# EAGLE design bierkasten (EAGLE 9.1.3)
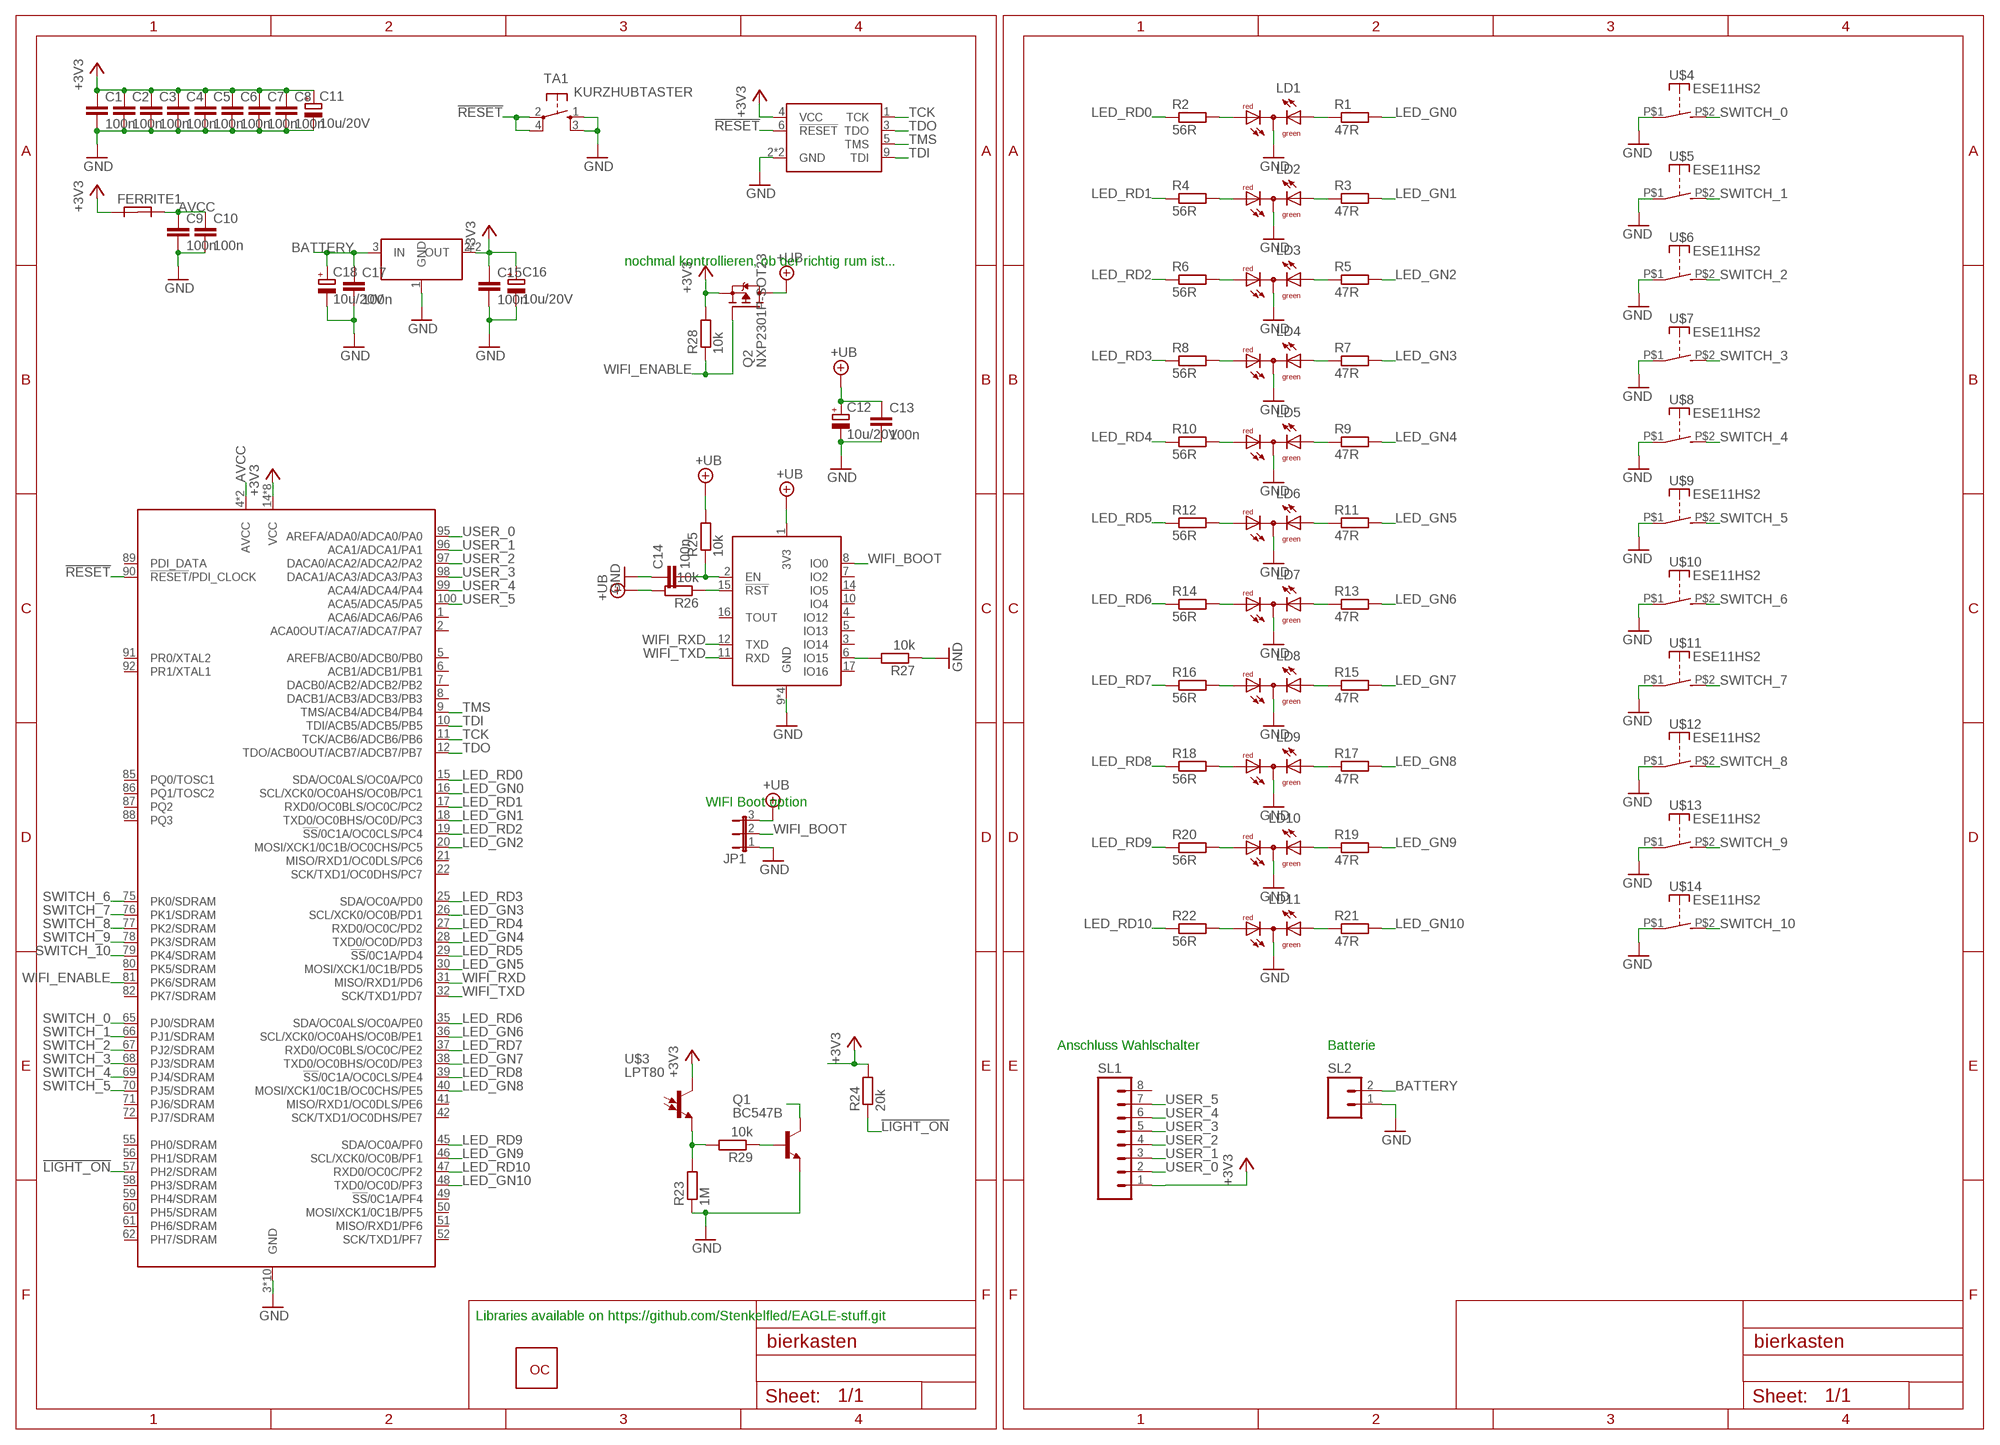
[diagram p0: schematic, sheet 1]

## Parts
C1  100n  C-EUC0603  [C0603]
C2  100n  C-EUC0603  [C0603]
C3  100n  C-EUC0603  [C0603]
C4  100n  C-EUC0603  [C0603]
C5  100n  C-EUC0603  [C0603]
C6  100n  C-EUC0603  [C0603]
C7  100n  C-EUC0603  [C0603]
C8  100n  C-EUC0603  [C0603]
C9  100n  C-EUC0603  [C0603]
C10  100n  C-EUC0603  [C0603]
C11  10u/20V  CPOL-EUB/3528-21W  [B/3528-21W]
C12  10u/20V  CPOL-EUB/3528-21W  [B/3528-21W]
C13  100n  C-EUC0603  [C0603]
C14  100n  C-EUC0603  [C0603]
C15  100n  C-EUC0603  [C0603]
C16  10u/20V  CPOL-EUB/3528-21W  [B/3528-21W]
C17  100n  C-EUC0603  [C0603]
C18  10u/20V  CPOL-EUB/3528-21W  [B/3528-21W]
FERRITE1  FERRITE-EU_0805  [L0805]
JP1  JP2E  [JP2]
LD1  DUOLED-RG-C-WIRE  [DUOLED-C-WIRE]
LD2  DUOLED-RG-C-WIRE  [DUOLED-C-WIRE]
LD3  DUOLED-RG-C-WIRE  [DUOLED-C-WIRE]
LD4  DUOLED-RG-C-WIRE  [DUOLED-C-WIRE]
LD5  DUOLED-RG-C-WIRE  [DUOLED-C-WIRE]
LD6  DUOLED-RG-C-WIRE  [DUOLED-C-WIRE]
LD7  DUOLED-RG-C-WIRE  [DUOLED-C-WIRE]
LD8  DUOLED-RG-C-WIRE  [DUOLED-C-WIRE]
LD9  DUOLED-RG-C-WIRE  [DUOLED-C-WIRE]
LD10  DUOLED-RG-C-WIRE  [DUOLED-C-WIRE]
LD11  DUOLED-RG-C-WIRE  [DUOLED-C-WIRE]
Q1  BC547B  [TO92]
Q2  NXP2301P-SOT23  [SOT23]
R1  47R  R-EU_R0603  [R0603]
R2  56R  R-EU_R0603  [R0603]
R3  47R  R-EU_R0603  [R0603]
R4  56R  R-EU_R0603  [R0603]
R5  47R  R-EU_R0603  [R0603]
R6  56R  R-EU_R0603  [R0603]
R7  47R  R-EU_R0603  [R0603]
R8  56R  R-EU_R0603  [R0603]
R9  47R  R-EU_R0603  [R0603]
R10  56R  R-EU_R0603  [R0603]
R11  47R  R-EU_R0603  [R0603]
R12  56R  R-EU_R0603  [R0603]
R13  47R  R-EU_R0603  [R0603]
R14  56R  R-EU_R0603  [R0603]
R15  47R  R-EU_R0603  [R0603]
R16  56R  R-EU_R0603  [R0603]
R17  47R  R-EU_R0603  [R0603]
R18  56R  R-EU_R0603  [R0603]
R19  47R  R-EU_R0603  [R0603]
R20  56R  R-EU_R0603  [R0603]
R21  47R  R-EU_R0603  [R0603]
R22  56R  R-EU_R0603  [R0603]
R23  1M  R-EU_R0603  [R0603]
R24  20k  R-EU_R0603  [R0603]
R25  10k  R-EU_R0603  [R0603]
R26  10k  R-EU_R0603  [R0603]
R27  10k  R-EU_R0603  [R0603]
R28  10k  R-EU_R0603  [R0603]
R29  10k  R-EU_R0603  [R0603]
SL1  M08  [08P]
SL2  M02  [02P]
TA1  KURZHUBTASTER  [TA93XX]
U$1  ATXMEGA_A1  [TQFP100]
U$2  AVR-JTAG-10  [WANNE10G]
U$3  LPT80  [LPT80]
U$4  ESE11HS2  SWITCH_SINGLE-WIRED  [2X2,54]
U$5  ESE11HS2  SWITCH_SINGLE-WIRED  [2X2,54]
U$6  ESE11HS2  SWITCH_SINGLE-WIRED  [2X2,54]
U$7  ESE11HS2  SWITCH_SINGLE-WIRED  [2X2,54]
U$8  ESE11HS2  SWITCH_SINGLE-WIRED  [2X2,54]
U$9  ESE11HS2  SWITCH_SINGLE-WIRED  [2X2,54]
U$10  ESE11HS2  SWITCH_SINGLE-WIRED  [2X2,54]
U$11  ESE11HS2  SWITCH_SINGLE-WIRED  [2X2,54]
U$12  ESE11HS2  SWITCH_SINGLE-WIRED  [2X2,54]
U$13  ESE11HS2  SWITCH_SINGLE-WIRED  [2X2,54]
U$14  ESE11HS2  SWITCH_SINGLE-WIRED  [2X2,54]
U$15  ESP8266-POLLIN  [ESP8266-POLLIN]
U$16  NCP1117ST33T3G  NCP1117ST33  [SOT223]
U$17  BESTELLTEILE  [BESTELLTEILE]

## Nets
!LIGHT_ON: R24.1 U$1.57(PH2/SDRAM)
!RESET: TA1.2(P) TA1.4(P1) U$1.90(!RESET!/PDI_CLOCK) U$2.6(!RESET)
+3V3: C1.1 C2.1 C3.1 C4.1 C5.1 C6.1 C7.1 C8.1 C11.+ C15.1 C16.+ FERRITE1.1 Q2.2(S) R24.2 R28.2 SL1.1 U$1.14(VCC) U$1.24(VCC) U$1.34(VCC) U$1.44(VCC) U$1.54(VCC) U$1.64(VCC) U$1.74(VCC) U$1.83(VCC) U$2.4(VCC) U$3.C U$16.2(OUT) U$16.4(OUT)
+UB: C12.+ C13.1 JP1.3 Q2.3(D) R25.2 R26.2 U$15.1(3V3)
AVCC: C9.1 C10.1 FERRITE1.2 U$1.4(AVCC) U$1.94(AVCC)
BATTERY: C17.1 C18.+ SL2.2 U$16.3(IN)
GND: C1.2 C2.2 C3.2 C4.2 C5.2 C6.2 C7.2 C8.2 C9.2 C10.2 C11.- C12.- C13.2 C14.1 C15.2 C16.- C17.2 C18.- JP1.1 LD1.C LD2.C LD3.C LD4.C LD5.C LD6.C LD7.C LD8.C LD9.C LD10.C LD11.C Q1.1(E) R23.1 R27.1 SL2.1 TA1.1(S) TA1.3(S1) U$1.3(GND) U$1.13(GND) U$1.23(GND) U$1.33(GND) U$1.43(GND) U$1.53(GND) U$1.63(GND) U$1.73(GND) U$1.84(GND) U$1.93(GND) U$2.2(GND) U$2.10(GND) U$4.P$1(P) U$5.P$1(P) U$6.P$1(P) U$7.P$1(P) U$8.P$1(P) U$9.P$1(P) U$10.P$1(P) U$11.P$1(P) U$12.P$1(P) U$13.P$1(P) U$14.P$1(P) U$15.9(GND) U$15.13(GND) U$15.18(GND) U$15.19(GND) U$16.1(GND)
LED_GN0: R1.2 U$1.16(SCL/XCK0/OC0AHS/OC0B/PC1)
LED_GN1: R3.2 U$1.18(TXD0/OC0BHS/OC0D/PC3)
LED_GN2: R5.2 U$1.20(MOSI/XCK1/0C1B/OC0CHS/PC5)
LED_GN3: R7.2 U$1.26(SCL/XCK0/OC0B/PD1)
LED_GN4: R9.2 U$1.28(TXD0/OC0D/PD3)
LED_GN5: R11.2 U$1.30(MOSI/XCK1/0C1B/PD5)
LED_GN6: R13.2 U$1.36(SCL/XCK0/OC0AHS/OC0B/PE1)
LED_GN7: R15.2 U$1.38(TXD0/OC0BHS/OC0D/PE3)
LED_GN8: R17.2 U$1.40(MOSI/XCK1/0C1B/OC0CHS/PE5)
LED_GN9: R19.2 U$1.46(SCL/XCK0/OC0B/PF1)
LED_GN10: R21.2 U$1.48(TXD0/OC0D/PF3)
LED_RD0: R2.1 U$1.15(SDA/OC0ALS/OC0A/PC0)
LED_RD1: R4.1 U$1.17(RXD0/OC0BLS/OC0C/PC2)
LED_RD2: R6.1 U$1.19(!SS!/0C1A/OC0CLS/PC4)
LED_RD3: R8.1 U$1.25(SDA/OC0A/PD0)
LED_RD4: R10.1 U$1.27(RXD0/OC0C/PD2)
LED_RD5: R12.1 U$1.29(!SS!/0C1A/PD4)
LED_RD6: R14.1 U$1.35(SDA/OC0ALS/OC0A/PE0)
LED_RD7: R16.1 U$1.37(RXD0/OC0BLS/OC0C/PE2)
LED_RD8: R18.1 U$1.39(!SS!/0C1A/OC0CLS/PE4)
LED_RD9: R20.1 U$1.45(SDA/OC0A/PF0)
LED_RD10: R22.1 U$1.47(RXD0/OC0C/PF2)
N$1: LD1.AR R2.2
N$2: LD1.AX(AG) R1.1
N$3: LD2.AR R4.2
N$4: LD2.AX(AG) R3.1
N$5: LD3.AR R6.2
N$6: LD3.AX(AG) R5.1
N$7: LD4.AR R8.2
N$8: LD4.AX(AG) R7.1
N$9: LD5.AR R10.2
N$10: LD5.AX(AG) R9.1
N$11: LD6.AR R12.2
N$12: LD6.AX(AG) R11.1
N$13: LD7.AR R14.2
N$14: LD7.AX(AG) R13.1
N$15: LD8.AR R16.2
N$16: LD8.AX(AG) R15.1
N$17: LD9.AR R18.2
N$18: LD9.AX(AG) R17.1
N$19: LD10.AR R20.2
N$20: LD10.AX(AG) R19.1
N$21: LD11.AR R22.2
N$22: LD11.AX(AG) R21.1
N$23: R23.2 R29.2 U$3.E
N$24: C14.2 R25.1 U$15.2(EN)
N$25: R27.2 U$15.6(IO15)
N$26: R26.1 U$15.15(!RST)
N$27: Q1.3(C)
N$28: Q1.2(B) R29.1
SWITCH_0: U$1.65(PJ0/SDRAM) U$4.P$2(S)
SWITCH_1: U$1.66(PJ1/SDRAM) U$5.P$2(S)
SWITCH_2: U$1.67(PJ2/SDRAM) U$6.P$2(S)
SWITCH_3: U$1.68(PJ3/SDRAM) U$7.P$2(S)
SWITCH_4: U$1.69(PJ4/SDRAM) U$8.P$2(S)
SWITCH_5: U$1.70(PJ5/SDRAM) U$9.P$2(S)
SWITCH_6: U$1.75(PK0/SDRAM) U$10.P$2(S)
SWITCH_7: U$1.76(PK1/SDRAM) U$11.P$2(S)
SWITCH_8: U$1.77(PK2/SDRAM) U$12.P$2(S)
SWITCH_9: U$1.78(PK3/SDRAM) U$13.P$2(S)
SWITCH_10: U$1.79(PK4/SDRAM) U$14.P$2(S)
TCK: U$1.11(TCK/ACB6/ADCB6/PB6) U$2.1(TCK)
TDI: U$1.10(TDI/ACB5/ADCB5/PB5) U$2.9(TDI)
TDO: U$1.12(TDO/ACB0OUT/ACB7/ADCB7/PB7) U$2.3(TDO)
TMS: U$1.9(TMS/ACB4/ADCB4/PB4) U$2.5(TMS)
USER_0: SL1.2 U$1.95(AREFA/ADA0/ADCA0/PA0)
USER_1: SL1.3 U$1.96(ACA1/ADCA1/PA1)
USER_2: SL1.4 U$1.97(DACA0/ACA2/ADCA2/PA2)
USER_3: SL1.5 U$1.98(DACA1/ACA3/ADCA3/PA3)
USER_4: SL1.6 U$1.99(ACA4/ADCA4/PA4)
USER_5: SL1.7 U$1.100(ACA5/ADCA5/PA5)
WIFI_BOOT: JP1.2 U$15.8(IO0)
WIFI_ENABLE: Q2.1(G) R28.1 U$1.81(PK6/SDRAM)
WIFI_RXD: U$1.31(MISO/RXD1/PD6) U$15.12(TXD)
WIFI_TXD: U$1.32(SCK/TXD1/PD7) U$15.11(RXD)
Unconnected: SL1.8 U$1.1(ACA6/ADCA6/PA6) U$1.2(ACA0OUT/ACA7/ADCA7/PA7) U$1.5(AREFB/ACB0/ADCB0/PB0) U$1.6(ACB1/ADCB1/PB1) U$1.7(DACB0/ACB2/ADCB2/PB2) U$1.8(DACB1/ACB3/ADCB3/PB3) U$1.21(MISO/RXD1/OC0DLS/PC6) U$1.22(SCK/TXD1/OC0DHS/PC7) U$1.41(MISO/RXD1/OC0DLS/PE6) U$1.42(SCK/TXD1/OC0DHS/PE7) U$1.49(!SS!/0C1A/PF4) U$1.50(MOSI/XCK1/0C1B/PF5) U$1.51(MISO/RXD1/PF6) U$1.52(SCK/TXD1/PF7) U$1.55(PH0/SDRAM) U$1.56(PH1/SDRAM) U$1.58(PH3/SDRAM) U$1.59(PH4/SDRAM) U$1.60(PH5/SDRAM) U$1.61(PH6/SDRAM) U$1.62(PH7/SDRAM) U$1.71(PJ6/SDRAM) U$1.72(PJ7/SDRAM) U$1.80(PK5/SDRAM) U$1.82(PK7/SDRAM) U$1.85(PQ0/TOSC1) U$1.86(PQ1/TOSC2) U$1.87(PQ2) U$1.88(PQ3) U$1.89(PDI_DATA) U$1.91(PR0/XTAL2) U$1.92(PR1/XTAL1) U$15.3(IO14) U$15.4(IO12) U$15.5(IO13) U$15.7(IO2) U$15.10(IO4) U$15.14(IO5) U$15.16(TOUT) U$15.17(IO16)

## Notes on the sheet
- nochmal kontrollieren, ob der richtig rum ist...
- WIFI Boot option
- Anschluss Wahlschalter | Batterie
- Libraries available on https://github.com/Stenkelfled/EAGLE-stuff.git

## Library data of the parts
C1-C10 C13-C15 C17 = rcl_STE:C-EU: CAPACITOR, European symbol; FARNELL: 432210; REICHELT: X7R-G0603 100N; SPICEPREFIX: C
C11 C12 C16 C18 = rcl:CPOL-EU: POLARIZED CAPACITOR, European symbol; REICHELT: TAJ 3528 10/20; SPICEPREFIX: C
FERRITE1 = ferrite_STE:FERRITE-EU_0805: Ferritperle; REICHELT: BLM21PG 331
JP1 = jumper:JP2E: JUMPER
LD1-LD11 = opto_STE:DUOLED-RG-C: DUO LED 2 colors (red/green), 5 mm, round, common Cathode www.ligitek.com or other producers.; REICHELT: LED 5 RG-3
Q1 = transistor-npn:BC547*: NPN Transistor; REICHELT: BC 547B
Q2 = mosfet_STE:NXP2301P: P-MOSFET; REICHELT: NX2301P NXP
R1 R3 R5 R7 R9 R11 R13 R17 R19 R21 = rcl_STE:R-EU_: RESISTOR, European symbol; FARNELL: 2502461; REICHELT: RND 0603 1 47; SPICEPREFIX: R
R2 R4 R6 R8 R10 R12 R14 R16 R18 R20 R22 = rcl_STE:R-EU_: RESISTOR, European symbol; REICHELT: RND 0603 1 56; SPICEPREFIX: R
R15 = rcl:R-EU_: RESISTOR, European symbol; FARNELL: 2502461; REICHELT: RND 0603 1 47; SPICEPREFIX: R
R23 R29 = rcl_STE:R-EU_: RESISTOR, European symbol; REICHELT: RND 0603 1 1,0M; SPICEPREFIX: R
R24 = rcl_STE:R-EU_: RESISTOR, European symbol; REICHELT: RND 0603 1 20K; SPICEPREFIX: R
R25-R28 = rcl:R-EU_: RESISTOR, European symbol; FARNELL: 2502397; REICHELT: RND 0603 1 10K; SPICEPREFIX: R
SL1 = con-amp-quick:M08: AMP QUICK CONNECTOR; OC_FARNELL: unknown; OC_NEWARK: unknown; REICHELT: PSS 254/8G:PSK 254/8W
SL2 = con-amp-quick:M02: AMP QUICK CONNECTOR; OC_FARNELL: unknown; OC_NEWARK: unknown; REICHELT: PSS 254/2G:PSK 254/2W
TA1 = switch_STE:KURZHUBTASTER; FARNELL: 2292960; REICHELT: Taster 9314; WUERTH: 430 182 043 816
U$1 = uC_STE:ATXMEGA_A1; REICHELT: ATXMEGA 128A1-AU
U$2 = con_STE:AVR-JTAG; REICHELT: WSL 10G
U$3 = misc_STE:LPT80: Fototransistor; REICHELT: LPT 80
U$4-U$14 = switch_STE:SWITCH_SINGLE; REICHELT: ESE 11HS2
U$15 = misc_STE:ESP8266: https://www.pollin.de/p/espressif-esp-wroom-02-esp8266-wi-fi-modul-810696 Doku: https://www.pollin.de/productdownloads/D810696B.PDF
U$16 = power_STE:NCP1117ST33: 3,3V LDO-Linearregler; REICHELT: NCP 1117 ST33T3G
U$17 = misc_STE:BESTELLTEILE; REICHELT: SL 1X36G 2,54:JUMPER 2,54 GN*10:HALTER 4XUM3-1DK:CLIP 9V

## Net classes
0 default: width 0.2 mm
1 power: width 0.3 mm

## Board
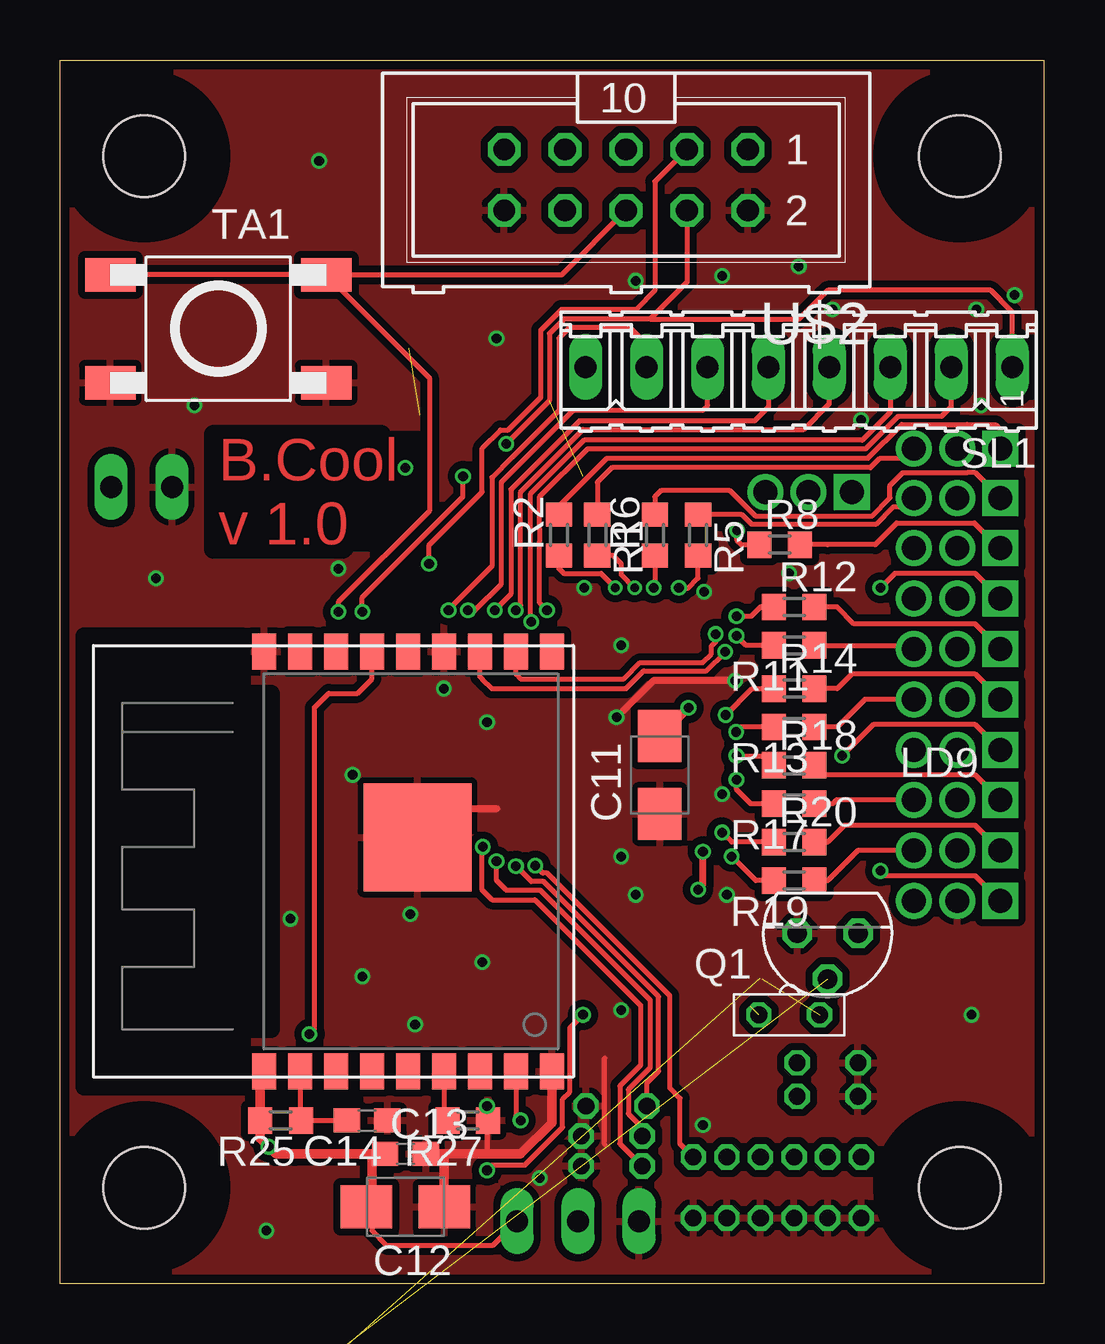
[diagram p1: board, top side]
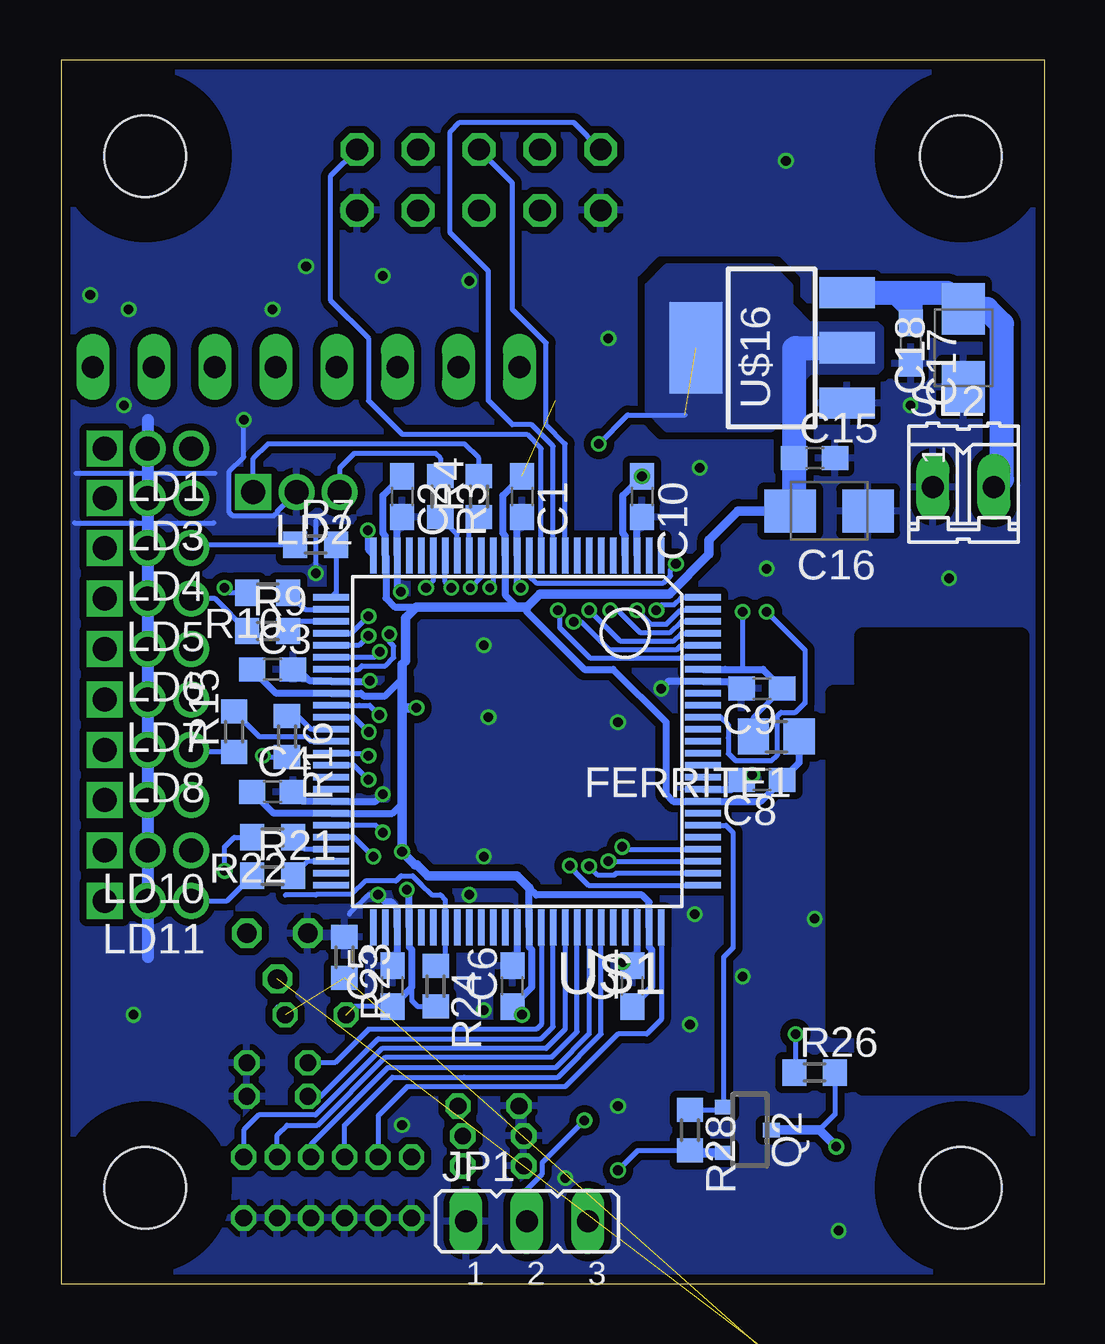
[diagram p2: board, bottom side, seen from below]

Size 41 x 51 mm. Coordinates in mm from the lower left corner, seen from the top.
Outline: 41,0 0,0 0,51 41,51 41,0
Copper layers (1*16): Top 0.035559375mm / dielectric 1.6mm / Bottom 0.035559375mm
Design rules "oshpark-2layer *": minimum track width 6mil, minimum drill 10mil, track to track 6mil, track to pad 6mil, pad to pad 6mil, via to via 6mil, smd to smd 0.1mm, copper to edge 15mil, drill to drill 6mil, minimum pad ring 5mil, minimum via ring 5mil, stop-mask expansion 2.5mil, vias tented up to drill 1mm, thermal gap 10mil
Holes 3.4 mm at 37.5,4 3.5,4 3.5,47 37.5,47
tRestrict: area 34.3,0.8 to 40.7,7.2; area 0.3,0.8 to 6.7,7.2; area 0.3,43.8 to 6.7,50.2; area 34.3,43.8 to 40.7,50.2; 8 lines
bRestrict: area 34.3,0.8 to 40.7,7.2; area 0.3,0.8 to 6.7,7.2; area 0.3,43.8 to 6.7,50.2; area 34.3,43.8 to 40.7,50.2

### Footprints (pad centres in the part's own frame; a part is rotated, then mirrored left to right if it is on the bottom)
C0603 = smd 1.1 x 1: 1 -0.85,0; 2 0.85,0
B/3528-21W = smd 2.15 x 1.8: + 1.625,0; - -1.625,0
L0805 = smd 1.3 x 1.5: 1 -0.95,0; 2 0.95,0
JP2 = drill 0.914 long: 1 -2.54,0; 2 0,0; 3 2.54,0
DUOLED-C-WIRE = drill 1 square: AR 1.8,0 | drill 1: AX -1.8,0; C 0,0
TO92 = drill 0.813 octagon: 1 1.27,0; 2 0,1.905; 3 -1.27,0
SOT23 = smd 0.6 x 0.7: 1 -0.95,-1; 2 0.95,-1; 3 0,1
R0603 = smd 1 x 1.1: 1 -0.85,0; 2 0.85,0
08P = drill 0.914 long: 1 -8.89,0; 2 -6.35,0; 3 -3.81,0; 4 -1.27,0; 5 1.27,0; 6 3.81,0; 7 6.35,0; 8 8.89,0
02P = drill 0.914 long: 1 -1.27,0; 2 1.27,0
TA93XX = smd 2.1 x 1.4: 1 4.5,2.25; 2 4.5,-2.25; 3 -4.5,2.25; 4 -4.5,-2.25
TQFP100 = smd 0.27 x 1.5: 1 -6,-7.75; 2 -5.5,-7.75; 3 -5,-7.75; 4 -4.5,-7.75; 5 -4,-7.75; 6 -3.5,-7.75; 7 -3,-7.75; 8 -2.5,-7.75; 9 -2,-7.75; 10 -1.5,-7.75; 11 -1,-7.75; 12 -0.5,-7.75; 13 0,-7.75; 14 0.5,-7.75; 15 1,-7.75; 16 1.5,-7.75; 17 2,-7.75; 18 2.5,-7.75; 19 3,-7.75; 20 3.5,-7.75; 21 4,-7.75; 22 4.5,-7.75; 23 5,-7.75; 24 5.5,-7.75; 25 6,-7.75; 51 6,7.75; 52 5.5,7.75; 53 5,7.75; 54 4.5,7.75; 55 4,7.75; 56 3.5,7.75; 57 3,7.75; 58 2.5,7.75; 59 2,7.75; 60 1.5,7.75; 61 1,7.75; 62 0.5,7.75; 63 0,7.75; 64 -0.5,7.75; 65 -1,7.75; 66 -1.5,7.75; 67 -2,7.75; 68 -2.5,7.75; 69 -3,7.75; 70 -3.5,7.75; 71 -4,7.75; 72 -4.5,7.75; 73 -5,7.75; 74 -5.5,7.75; 75 -6,7.75 | smd 1.5 x 0.27: 26 7.75,-6; 27 7.75,-5.5; 28 7.75,-5; 29 7.75,-4.5; 30 7.75,-4; 31 7.75,-3.5; 32 7.75,-3; 33 7.75,-2.5; 34 7.75,-2; 35 7.75,-1.5; 36 7.75,-1; 37 7.75,-0.5; 38 7.75,0; 39 7.75,0.5; 40 7.75,1; 41 7.75,1.5; 42 7.75,2; 43 7.75,2.5; 44 7.75,3; 45 7.75,3.5; 46 7.75,4; 47 7.75,4.5; 48 7.75,5; 49 7.75,5.5; 50 7.75,6; 76 -7.75,6; 77 -7.75,5.5; 78 -7.75,5; 79 -7.75,4.5; 80 -7.75,4; 81 -7.75,3.5; 82 -7.75,3; 83 -7.75,2.5; 84 -7.75,2; 85 -7.75,1.5; 86 -7.75,1; 87 -7.75,0.5; 88 -7.75,0; 89 -7.75,-0.5; 90 -7.75,-1; 91 -7.75,-1.5; 92 -7.75,-2; 93 -7.75,-2.5; 94 -7.75,-3; 95 -7.75,-3.5; 96 -7.75,-4; 97 -7.75,-4.5; 98 -7.75,-5; 99 -7.75,-5.5; 100 -7.75,-6
WANNE10G = drill 0.914 octagon: 1 -5.08,-1.27; 2 -5.08,1.27; 3 -2.54,-1.27; 4 -2.54,1.27; 5 0,-1.27; 6 0,1.27; 7 2.54,-1.27; 8 2.54,1.27; 9 5.08,-1.27; 10 5.08,1.27
LPT80 = drill 0.7 octagon: C 1.27,0; E -1.27,0
2X2,54 = drill 0.7 octagon: P$1 -1.27,0; P$2 1.27,0
ESP8266-POLLIN = smd 1.5 x 1: 1 -9.55,6.3; 2 -9.55,4.8; 3 -9.55,3.3; 4 -9.55,1.8; 5 -9.55,0.3; 6 -9.55,-1.2; 7 -9.55,-2.7; 8 -9.55,-4.2; 9 -9.55,-5.7; 10 7.95,-5.7; 11 7.95,-4.2; 12 7.95,-2.7; 13 7.95,-1.2; 14 7.95,0.3; 15 7.95,1.8; 16 7.95,3.3; 17 7.95,4.8; 18 7.95,6.3 | smd 4.5 x 4.5: 19 0.2,-0.1
SOT223 = smd 1.3 x 2.3: 1 -2.3,-3.15; 2 0,-3.15; 3 2.3,-3.15 | smd 3.8 x 2.2: 4 0,3.15

### Placement (x,y rotation side)
C1  21.8,32.8 270 bottom
C2  26.8,32.8 270 bottom
C3  32.2,25.6 0 bottom
C4  32.2,20.5 0 bottom
C5  27.2,12.4 90 bottom
C6  22.2,12.4 90 bottom
C7  17.2,12.4 90 bottom
C8  11.8,21 180 bottom
C9  11.8,24.8 180 bottom
C10  16.8,32.8 270 bottom
C11  25,21.2 90 top
C12  14.4,3.2 180 top
C13  14.4,5.4 0 top
C14  12.8,6.8 180 top
C15  9.6,34.4 0 bottom
C16  9,32.2 180 bottom
C17  5.6,39.2 270 bottom
C18  3.4,39 90 bottom
FERRITE1  11.2,22.8 180 bottom
JP1  21.6,2.6 0 bottom
LD1  37.4,34.8 180 bottom
LD2  31.2,33 180 bottom
LD3  37.4,32.75 180 bottom
LD4  37.4,30.65 180 bottom
LD5  37.4,28.55 180 bottom
LD6  37.4,26.45 180 bottom
LD7  37.4,24.35 180 bottom
LD8  37.4,22.25 180 bottom
LD9  37.4,20.15 0 top
LD10  37.4,18.05 180 bottom
LD11  37.4,15.95 180 bottom
Q1  32,14.6 180 top
Q2  12.4,6.4 270 bottom
R1  22.4,31.2 270 top
R2  20.8,31.2 90 top
R3  25.2,32.8 270 bottom
R4  23.6,32.8 90 bottom
R5  26.6,31.2 270 top
R6  24.8,31.2 90 top
R7  30.4,30.8 0 bottom
R8  30,30.8 0 top
R9  32.4,27.2 0 bottom
R10  32.4,28.8 180 bottom
R11  30.6,26.6 180 top
R12  30.6,28.2 0 top
R13  30.6,23.2 180 top
R14  30.6,24.8 0 top
R15  33.8,23 90 bottom
R16  31.6,22.8 270 bottom
R17  30.6,20 180 top
R18  30.6,21.6 0 top
R19  30.6,16.8 180 top
R20  30.6,18.4 0 top
R21  32.2,17 0 bottom
R22  32.2,18.6 180 bottom
R23  29.2,13.6 270 bottom
R24  25.4,12.4 270 bottom
R25  9.2,6.8 180 top
R26  9.6,8.8 0 bottom
R27  17,6.8 180 top
R28  14.8,6.4 270 bottom
R29  1.4,-11.2 0 top  (outside the outline)
SL1  30.8,38.2 180 top
SL2  3.4,33.2 0 bottom
TA1  6.6,39.8 180 top
U$1  22,22.6 180 bottom
U$2  23.6,46 180 top
U$3  30.4,11.2 180 top
U$4  32,9.2 0 bottom
U$5  32,7.8 0 bottom
U$6  33.4,4 90 bottom
U$7  32,4 90 bottom
U$8  30.6,4 90 bottom
U$9  29.2,4 90 bottom
U$10  27.8,4 90 bottom
U$11  26.4,4 90 bottom
U$12  23.2,7.4 180 bottom
U$13  23,6.15 180 bottom
U$14  23,4.9 180 bottom
U$15  14.8,18.4 90 top
U$16  11.4,39 90 bottom
U$17  160.2,0 0 bottom  (outside the outline)

### Tracks (layer width: path | path; a pad name or v marks a point on that pad's centre or on a via)
!LIGHT_ON
  Bottom 0.2: R24.1 25,13.65 U$1.57 25,16 25.2,16.2 25.56,16.2 26.02,16.66 26.36,17 26.84,17 27.06,16.78 28.33,16.78 28.89,16.21 30.39,16.21 30.4,16.2 31.67,16.2
!RESET  (via drill 0.4)
  Top 0.2: TA1.4 20.92,42.05 U$2.6 | TA1.4 TA1.2 | TA1.4 15.4,37.75 15.4,32.2 11.6,28.4 v11.6,28
  Bottom 0.2: U$1.90 13.51,23.6 13.2,23.29 13.2,22.75 13.2,22.09 12.9,21.8 11.39,21.8 11.15,22.04 11.15,23.66 11.01,23.8 10.39,23.8 10,24.2 10,26.4 v11.6,28
+3V3  (via drill 0.4)  (3 unrouted)
  Top 0.2: 24.6,40.2 21,40.2 20.4,39.6 20.4,36.8 v18.6,35 | SL1.1 39.69,40.49 39.22,40.96 39.22,40.98 38.8,41.4 32,41.4 31.8,41.2 30.8,40.2 24.6,40.2 | v17.8,4.72 18.03,4.95 19.39,4.95 20.95,6.51 20.95,7.7 21.25,8 21.25,10.65 v21.8,11.2 | 24.6,40.2 26.14,41.74 26.14,42.04 U$2.4
  Top 0.3: v26.6,16.42 26.8,16.62 v26.8,18
  Top 0.4: C11.+ 26.18,24 v26.2,24
  Bottom 0.2: 26.4,12.35 26.4,11.8 26.15,11.55 R24.2 | C5.1 28.78,11.55 | C6.1 21.85,11.2 v21.8,11.2 | v17.8,4.72 16.97,5.55 R28.2 | 21.6,28.2 22,28.2 | v18.6,35 17.4,36.2 15,36.2
  Bottom 0.3: C3.1 32.05,24.6 U$1.34 28.51,24.6 28.41,24.5 27.5,24.5 26.8,25.2 | C4.1 32.15,19.6 U$1.44 27.2,19.6 26.8,20 | C2.1 27.6,32.85 27.6,31.27 27.5,31.17 U$1.24 27.48,30.33 27.48,28.57 27.11,28.2 26,28.2 | C5.1 26.4,12.35 26.4,13.93 26.5,14.03 U$1.54 26.5,16.32 v26.6,16.42 | C6.1 21.4,12.35 21.4,13.93 21.5,14.03 U$1.64 21.5,16.5 21.2,16.2 16.8,16.2 16.5,15.9 U$1.74 16.5,14.03 16.4,13.93 16.4,12.35 C7.1 | C1.1 22.6,32.85 22.6,31.27 22.5,31.17 U$1.14 22.5,28.7 22,28.2 | FERRITE1.1 10.25,21.7 C8.1 11.85,20.1 U$1.83 15.5,20.1 15.8,20.4 15.8,23.4 18,25.6 19.2,25.6 21.6,28 21.6,28.2
  Bottom 0.4: Q2.2 14.7,5.45 R28.2 | 26.8,24 26.8,25.2 26.8,25.8 26.65,25.95 26.65,27.75 26.2,28.2 26,28.2 22,28.2 21.6,28.2 21.05,28.75 19.6,28.75 18.4,28.75 15.65,28.75 14,30.4 14,31 12.8,32.2 C16.+ | 26.8,24 26.8,20 v26.8,18 26.25,17.45 26.17,17.45 25.72,17 22,17 21.5,16.5 | v26.2,24 26.8,24
  Bottom 1: U$16.2 10.4,39 10.45,38.95 C15.1 10.45,32.38 C16.+
  pour Bottom (isolate 0.3, no thermals): 7.4,40 9.8,40 10.6,40.8 10.6,41.6 11.4,42.4 15.8,42.4 16.6,41.6 16.6,36.4 15.8,35.6 11.4,35.6 10.6,36.4 10.6,37.2 9.8,38 7,38 6.8,38.2 6.8,39.8 7,40
+UB  (via drill 0.4)
  Top 0.2: 13,3.42 13,2.2 13.6,1.6 18.06,1.6 JP1.3
  Top 0.4: 13,5.4 C13.1 | C12.+ 13,3.42 13,5.4 | 13,5.4 9.8,5.4 9,5.4 v8.7,5.7 8.35,6.05 R25.2 8.35,8.7 U$15.1
  Bottom 0.2: R26.2 8.75,7.05 9.4,6.4
  Bottom 0.4: Q2.3 9.4,6.4 v8.7,5.7
AVCC  (via drill 0.4)
  Top 0.2: v12.6,28 12.6,28.6 16.8,32.8 C10.1
  Bottom 0.2: 12.6,25.6 v12.6,28 | FERRITE1.2 12.15,23.6 C9.1
  Bottom 0.3: U$1.4 17.5,31.17 17.6,31.27 17.6,32.85 C10.1 | U$1.94 13.33,25.6 13.32,25.6 12.6,25.6 11.75,25.6 C9.1
  other vias: 16.8,33.65
BATTERY
  Bottom 1: U$16.3 6.2,41.3 | 6.2,41.3 4.08,41.3 C18.+ 2.42,40.62 1.8,40 1.8,33.53 SL2.2 | C17.1 5.6,40.7 6.2,41.3
GND  (via drill 0.4)
  Top 0.2: R27.1 17.8,6.75 17.8,5.4 | 22.7,5.8 22.7,9.4
  Top 0.3: 16.6,19.8 18.2,19.8 | v28.15,25.13 24.73,25.13 v23.2,23.6
  Top 0.4: C13.2 16,5.4 | 16,5.4 17.8,5.4 19.2,5.4 20.5,6.7 U$15.9 | C12.- 16,3.23 16,5.4
  Bottom 0.2: C8.2 12.4,21 v12.2,21.2 | v26.85,28.83 27,28.98 27,29.6 | LD2.C 32,32.2 32,32.15 32.15,32 33.85,32 34,32.15 34,33.85 33.4,34.46 v33.4,36 | 30.4,31.8 30.4,29.4 | 28.2,16.2 v27.8,16.2 28.2,16.2 | 28.2,16.2 29,15.4 | 40.45,31.7 34.65,31.7 | 40.4,33.78 34.6,33.78
  Bottom 0.3: C3.2 31.13,25.6 30.64,25.11 29.77,25.11 U$1.33 28.18,25.1 v28.15,25.13 | C4.2 30.95,20.1 U$1.43 27.9,20.1 v27.6,20.4 | U$1.84 13.05,20.6 C8.2 | C5.2 27,13.45 U$1.53 27,15.66 27.24,15.9 27.5,15.9 v27.8,16.2 | U$1.73 17,13.45 C7.2 | U$1.63 22,13.45 C6.2 | C1.2 22,31.75 U$1.13 22,29.15 v21.85,29 | U$1.3 17,31.75 C10.2 | C2.2 27,31.75 U$1.23 27,29.6 27,28.98 v26.85,28.83 | C9.2 12.95,25.1 U$1.93 15.7,25.1 v16,24.8
  Bottom 0.5: 37.4,36 37.4,13.6
  other vias: 24,41.8 27.6,42 30.8,42.4 8.6,2.2 12.6,12.8 4,29.4 5.6,36.6 18.2,39.4 11.6,29.8 10.8,46.8 14.4,34 39.8,41.2 38.2,40.6 32.2,40.6 38.4,36.6 14.6,15.4 14.8,10.8 17.8,7.4 20,4.4 23.4,11.4 26.8,6.6 38,11.2 24,16.2 23.4,17.8 17.6,13.4 17.8,23.4 23.4,26.6 30.4,29.6 9.6,15.2
  pour Top (isolate 0.3, rank 6): 0,0 0,51 41,51 41,0
  pour Bottom (isolate 0.3, rank 6): 0,0 0,51 41,51 41,0
LED_GN0  (via drill 0.35)
  Top 0.2: v23.95,29 23.4,29.55 23.4,30 23.05,30.35 R1.2
  Bottom 0.2: U$1.16 23.5,29.45 v23.95,29
LED_GN1
  Bottom 0.2: U$1.18 24.5,31.25 R3.2
LED_GN2  (via drill 0.4)
  Top 0.2: v25.8,29 26.2,29 26.6,29.4 R5.2
  Bottom 0.2: U$1.20 25.5,29.3 v25.8,29
LED_GN3
  Bottom 0.2: R7.2 29.55,28.8 U$1.26
LED_GN4
  Bottom 0.2: U$1.28 31.15,27.6 R9.2
LED_GN5  (via drill 0.4)
  Top 0.2: U$1.30 28.6,26.6 v28.2,27
  Bottom 0.2: v28.2,27 28.6,26.6 U$1.30
LED_GN6  (via drill 0.4)
  Top 0.2: R13.2 28.4,23.2 v28.19,22.99
  Bottom 0.2: v28.19,22.99 28.8,23.6 U$1.36
LED_GN7
  Bottom 0.2: U$1.38 30.6,22.6 30.8,22.8 32.75,22.8 R15.2
LED_GN8  (via drill 0.4)
  Top 0.2: R17.2 28.8,20 28.2,20.6 v28.2,21
  Bottom 0.2: v28.2,21 28.8,21.6 U$1.40
LED_GN9  (via drill 0.4)
  Top 0.2: R19.2 29,16.8 v28,17.8
  Bottom 0.2: v28,17.8 28.8,18.6 U$1.46
LED_GN10
  Bottom 0.2: U$1.48 30.75,17.6 R21.2
LED_RD0  (via drill 0.35)
  Top 0.2: R2.1 20.8,29.8 21,29.6 22.55,29.6 v23.15,29
  Bottom 0.2: U$1.15 23,29.15 v23.15,29
LED_RD1
  Bottom 0.2: U$1.17 24,31.55 R4.1
LED_RD2  (via drill 0.4)
  Top 0.2: R6.1 24.8,29.05 v24.75,29
  Bottom 0.2: v24.75,29 25,29.25 U$1.19
LED_RD3  (via drill 0.4)
  Top 0.2: v28.23,31.4 28.2,31.37 28.2,31 28.4,30.8 R8.1
  Bottom 0.2: U$1.25 28.23,30.58 v28.23,31.4
LED_RD4
  Bottom 0.2: R10.1 30.85,28.1 U$1.27
LED_RD5  (via drill 0.4)
  Top 0.2: R12.1 29.2,28.2 28.81,27.81 v28.2,27.81
  Bottom 0.2: U$1.29 28.92,27.1 28.21,27.81 v28.2,27.81
LED_RD6  (via drill 0.4)
  Top 0.2: v27.75,23.7 28.85,24.8 R14.1
  Bottom 0.2: U$1.35 28.58,24.1 28.15,24.1 v27.75,23.7
LED_RD7
  Bottom 0.2: U$1.37 30.6,23.1 31.15,23.65 R16.1
LED_RD8  (via drill 0.4)
  Top 0.2: v28.2,22 29.35,22 R18.1
  Bottom 0.2: U$1.39 28.3,22.1 v28.2,22
LED_RD9  (via drill 0.4)
  Top 0.2: R20.1 28,18.4 v27.6,18.8
  Bottom 0.2: v27.6,18.8 27.9,19.1 U$1.45
LED_RD10
  Bottom 0.2: U$1.47 30.85,18.1 R22.1
N$1
  Top 0.2: R2.2 20.8,32.4 22.8,34.4 33.68,34.4 35.09,35.8 37.81,35.8 37.82,35.8 39,35.8 39.2,35.6 LD1.AR
N$2
  Top 0.2: R1.1 22.4,33.4 23,34 33.78,34 34.16,34.38 35.18,34.38 LD1.AX
N$3
  Bottom 0.2: R4.2 23.6,34.4 24.2,35 32.4,35 33,34.4 LD2.AR
N$4
  Bottom 0.2: R3.1 25.2,34.4 25.4,34.6 28.8,34.6 29.4,34 LD2.AX
N$5
  Top 0.2: LD3.AR 38.15,33.8 37.82,33.8 | 37.81,33.8 37.82,33.8 | R6.2 24.8,32.8 25.05,33.05 27.93,33.05 28.98,32 33.85,32 34.6,32.74 34.6,33.27 35.13,33.8 37.81,33.8 | 37.81,33.8 37.82,33.8
N$6
  Top 0.2: LD3.AX 35.2,32.35 34.71,32.35 34,31.64 28.84,31.64 28.43,32.05 R5.1
N$7
  Top 0.2: R8.2 32,30.8 33.98,30.8 34.88,31.7 38.12,31.7 39.17,30.65 LD4.AR
N$8
  Bottom 0.2: LD4.AX 35.45,30.8 R7.1
N$9  (via drill 0.4)
  Top 0.2: LD5.AR 38.15,29.6 34.8,29.6 v34.2,29
  Bottom 0.2: v34.2,29 34,28.8 R10.2
N$10
  Bottom 0.2: R9.1 34.6,28.55 LD5.AX
N$11
  Top 0.2: LD6.AR 38.15,27.5 33.1,27.5 32.4,28.2 R12.2
N$12
  Top 0.2: R11.1 35.45,26.6 LD6.AX
N$13
  Top 0.2: LD7.AR 38.15,25.4 33,25.4 32.4,24.8 R14.2
N$14
  Top 0.2: LD7.AX 33.55,24.35 32.4,23.2 R13.1
N$15  (via drill 0.4)
  Top 0.2: LD8.AR 38.15,23.3 33.9,23.3 v32.6,22
  Bottom 0.2: v32.6,22 32.55,21.95 R16.2
N$16
  Bottom 0.2: R15.1 35.5,22.15 LD8.AX
N$17
  Top 0.2: LD9.AR 38.15,21.2 31.85,21.2 R18.2
N$18
  Top 0.2: LD9.AX 32.35,20.15 32.2,20 R17.1
N$19
  Top 0.2: LD10.AR 38.15,19.1 32.7,19.1 32,18.4 R20.2
N$20
  Top 0.2: LD10.AX 33.25,18.05 32,16.8 R19.1
N$21  (via drill 0.4)
  Top 0.2: LD11.AR 38.15,17 34.4,17 v34.2,17.2
  Bottom 0.2: v34.2,17.2 34.2,18.2 33.8,18.6 R22.2
N$22
  Bottom 0.2: LD11.AX 34.1,15.95 R21.1
N$23  (2 unrouted)
  Bottom 0.2: 29.25,12.7 R23.2 | 32,11.53 U$3.E
N$24
  Top 0.2: U$15.2 10,6.85 R25.1 C14.2
N$25
  Top 0.2: U$15.6 16,6.95 R27.2
N$26  (via drill 0.4)
  Top 0.2: v10.4,10.4 10.6,10.6 10.6,24 11.2,24.6 12.4,24.6 13,25.2 U$15.15
  Bottom 0.2: v10.4,10.4 10.4,8.85 R26.1
N$28  (1 unrouted)
SWITCH_0
  Bottom 0.2: U$1.65 21,14.1 21,14.09 21,10.8 21.2,10.6 28.2,10.6 29.6,9.2 U$4.P$2
SWITCH_1
  Bottom 0.2: U$1.66 20.5,10.7 21,10.2 27.8,10.2 30.2,7.8 U$5.P$2
SWITCH_2
  Bottom 0.2: U$1.67 20,10.6 20.8,9.8 27.63,9.8 30.41,7.02 32.78,7.02 33.4,6.4 U$6.P$2
SWITCH_3
  Bottom 0.2: U$1.68 19.5,10.5 20.55,9.45 27.48,9.45 30.33,6.6 31.6,6.6 32,6.2 U$7.P$2
SWITCH_4
  Bottom 0.2: U$1.69 19,10.4 20.4,9 27.4,9 30.6,5.8 U$8.P$2
SWITCH_5
  Bottom 0.2: U$1.70 18.5,10.4 20.3,8.6 24.2,8.6 27.2,8.6 29.2,6.6 U$9.P$2
SWITCH_6
  Bottom 0.2: U$1.75 16,14.1 15.99,14.09 15.99,11.01 16.6,10.4 17.8,10.4 20,8.2 26.6,8.2 27.8,7 U$10.P$2
SWITCH_7  (via drill 0.4)
  Top 0.2: v19.81,17.41 20.12,17.11 20.31,17.11 25.42,11.99 25.42,8.15 25.85,7.72 25.85,5.82 U$11.P$2
  Bottom 0.2: v19.81,17.41 19.59,17.19 19.59,17.16 19.03,16.6 U$1.76
SWITCH_8  (via drill 0.4)
  Top 0.2: v19.01,17.4 19.65,16.75 20.16,16.75 24.95,11.96 24.95,8.85 24.47,8.37 U$12.P$2
  Bottom 0.2: v19.01,17.4 18.63,17.02 17.96,17.02 17.88,17.1 U$1.77
SWITCH_9  (via drill 0.4)
  Top 0.2: v18.2,17.6 18.2,16.8 18.6,16.4 20.02,16.4 24.6,11.82 24.6,9 23.69,8.09 23.69,7.08 24.27,6.5 U$13.P$2
  Bottom 0.2: v18.2,17.6 U$1.78
SWITCH_10  (via drill 0.4)
  Top 0.2: v17.63,18.2 17.6,18.17 17.6,16.4 18,16 19.8,16 24.2,11.6 24.2,9.1 23.34,8.24 23.34,5.83 U$14.P$2
  Bottom 0.2: v17.63,18.2 17.53,18.1 U$1.79
TCK
  Bottom 0.2: U$1.11 21,34.8 21.6,35.4 26.8,35.4 28.2,36.8 28.2,39.4 29.8,41 29.8,46.15 U$2.1
TDI
  Bottom 0.2: U$1.10 20.5,34.9 21.4,35.8 22.2,35.8 23.2,36.8 23.2,42.2 24.8,43.8 24.8,48 24.4,48.4 19.65,48.4 U$2.9
TDO  (via drill 0.4)
  Top 0.2: v15.39,30 15.39,30.79 17.6,33 17.6,34.82 18.36,35.58 18.68,35.58 20.05,36.95 20.05,39.75 20.9,40.6 24,40.6 24.8,41.4 24.8,45.93 U$2.3
  Bottom 0.2: U$1.12 21.5,29.5 21.2,29.2 15.91,29.2 15.61,29.5 15.61,29.77 v15.39,30
TMS
  Bottom 0.2: U$1.9 20,35 20.8,35.8 20.8,39.2 22.2,40.6 22.2,45.87 U$2.5
USER_0  (via drill 0.4)
  Top 0.2: SL1.2 37.15,36.55 36.76,36.16 34.94,36.16 33.58,34.8 22,34.8 20,32.8 20,31.45 20,31.44 20,30.96 20,30.95 20,28.37 v20.3,28.07
  Bottom 0.2: U$1.95 15.17,26.1 15.19,26.08 18.97,26.08 20.23,27.34 20.23,28 v20.3,28.07
USER_1  (via drill 0.4)
  Top 0.2: SL1.3 34.61,36.33 33.44,35.15 21.85,35.15 19.6,32.9 19.6,27.63 v19.65,27.58
  Bottom 0.2: v19.65,27.58 19.33,27.58 18.18,26.43 15.34,26.43 15.17,26.6 U$1.96
USER_2  (via drill 0.4)
  Top 0.2: SL1.4 32.07,36.67 31,35.6 21.8,35.6 19.2,33 19.2,28.27 v19,28.07
  Bottom 0.2: U$1.97 15.16,27.1 15.48,26.78 17.72,26.78 v19,28.07
USER_3  (via drill 0.4)
  Top 0.2: SL1.5 29.53,36.53 28.95,35.95 21.65,35.95 18.8,33.1 18.8,28.74 v18.13,28.07
  Bottom 0.2: v18.13,28.07 17.83,28.07 16.89,27.14 15.63,27.14 15.16,27.6 U$1.98
USER_4  (via drill 0.4)
  Top 0.2: SL1.6 26.99,36.61 27,36.6 26.8,36.4 21.4,36.4 18.4,33.4 18.4,29.16 17.31,28.07 v17.01,28.07
  Bottom 0.2: U$1.99 14.28,28.07 15.19,28.07 15.77,27.49 16.44,27.49 16.78,27.83 16.78,27.84 v17.01,28.07
USER_5  (via drill 0.4)
  Top 0.2: SL1.7 24.45,39.15 23.75,39.85 21.25,39.85 20.8,39.4 20.8,36.38 18.84,34.42 18.82,34.42 18,33.6 18,29.9 16.2,28.1 v16.2,28.07
  Bottom 0.2: v16.2,28.07 15.97,28.3 15.46,28.3 15.16,28.6 U$1.100
WIFI_BOOT  (via drill 0.4)
  Top 0.2: U$15.8 19,7 v19.2,6.8
  Bottom 0.2: v19.2,6.8 20.95,5.05 20.95,4.58 21.6,3.93 JP1.2
WIFI_ENABLE
  Bottom 0.2: R28.1 13.5,7.25 Q2.1 13.4,13.6 13,14 13,18.8 13.3,19.1 U$1.81
WIFI_RXD  (via drill 0.4)
  Top 0.2: 17.5,25.3 17.6,25.2 | 17.6,25.2 18,24.8 23.6,24.8 24.33,25.53 26.93,25.53 v27.73,26.33 | 17.6,25.2 17.5,25.3 | 17.5,25.3 U$15.12
  Bottom 0.2: v27.73,26.33 27.96,26.1 U$1.31
WIFI_TXD  (via drill 0.4)
  Top 0.2: U$15.11 19,25.4 19.2,25.2 23.5,25.2 24.19,25.88 26.79,25.88 27.15,26.25 27.15,26.57 27.33,26.75 v27.33,27.07
  Bottom 0.2: U$1.32 28.62,25.6 28.47,25.75 27.49,25.75 27.15,26.09 27.15,26.57 27.33,26.75 v27.33,27.07

### Text on the board
Top: B.Cool / v 1.0